# EAGLE board Replicape (EAGLE 5.12), part 1 of 2
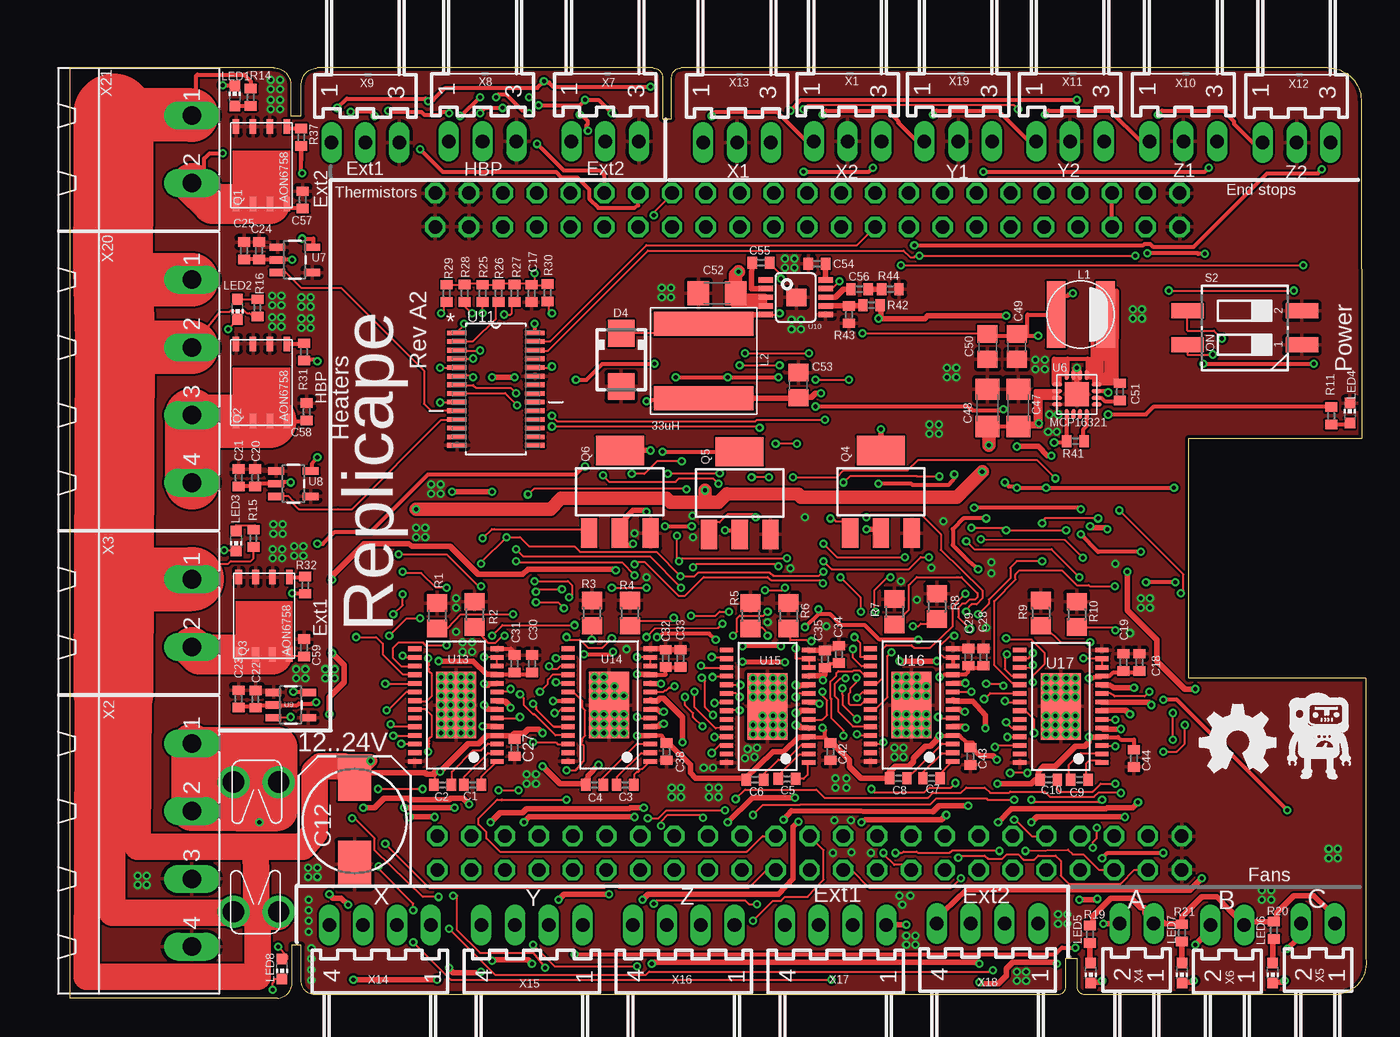
[diagram p3: board, top side]
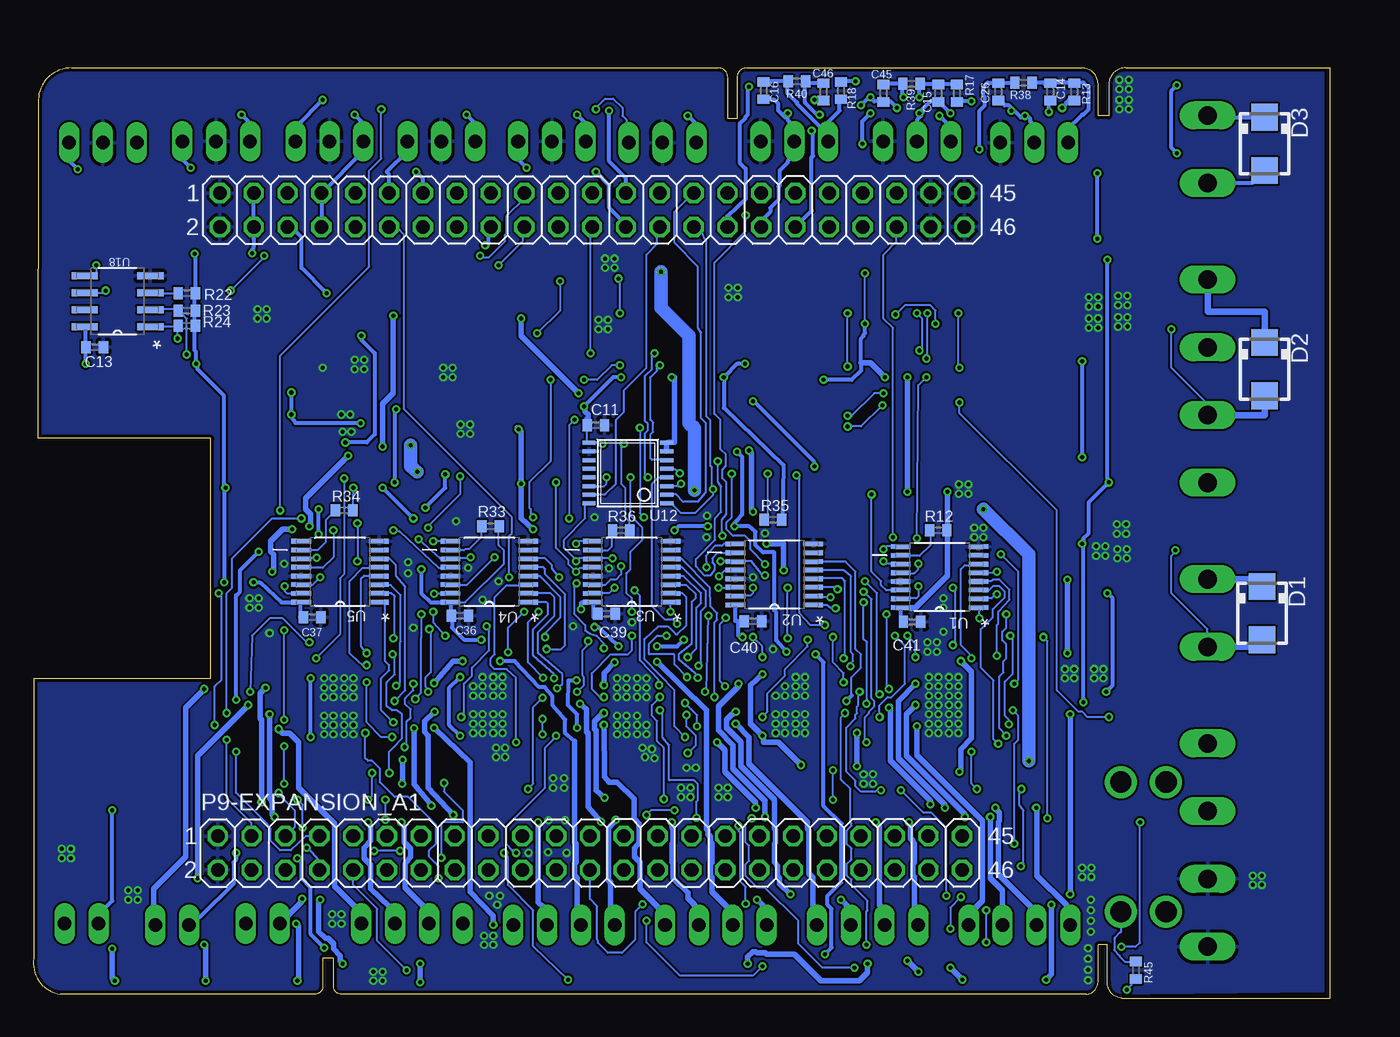
[diagram p4: board, bottom side, seen from below]

Size 97.32 x 69.8 mm. Coordinates in mm from the lower left corner, seen from the top.
Outline: 16.7,4 17.4,4 17.4,1.3 arc90 18.3,0.3 74.2,0.3 arc90 74.8,0.9 74.8,3 75.6,3 75.6,0.9 arc90 76.2,0.3 95.3,0.3 arc90 97.3,3 97.3,24 84,24 84,42 97,42 96.95,67.4 arc90 94.45,69.8 45.9,69.8 arc90 45.2,69.1 45.2,66 44.5,66 44.5,69.1 arc90 43.8,69.8 18.6,69.8 arc90 17.4,68.6 17.4,66.2 16.6,66.2 16.6,68.6 arc90 15.3,69.8 0,69.8 0,0 15.6,0 arc90 16.7,1.2 16.7,4
Copper layers (1*16): Top 0.035mm / dielectric 1.5mm / Bottom 0.035mm
Design rules "Fusion_eagle_rule_v1.1": minimum track width 6mil, minimum drill 12mil, track to track 6mil, track to pad 6mil, pad to pad 6mil, via to via 6mil, smd to smd 0mil, copper to edge 10mil, drill to drill 10mil, minimum pad ring 10mil, minimum via ring 6mil, stop-mask expansion 2mil, vias tented up to drill 100mil, thermal gap 10mil
Net classes: 1 power: width 1.27 mm

## Footprints (pad centres in the part's own frame; a part is rotated, then mirrored left to right if it is on the bottom)
C0402 = smd 0.7 x 0.9: 1 -0.65,0; 2 0.65,0
140CLH-0810 = smd 3.5 x 2.5: + 3.25,0; - -3.25,0
C1206 = smd 1.6 x 1.8: 1 -1.4,0; 2 1.4,0
C0805 = smd 1.3 x 1.5: 1 -0.95,0; 2 0.95,0
SMA = smd 2 x 2: A 2,0; C -2,0
3557 = drill 1.6 round: 1 -4.865,1.7; 2 -4.865,-1.7; 3 4.865,-1.7; 4 4.865,1.7
VLC5020 = smd 5 x 1.4: 1 0,1.85; 2 0,-1.85
NR8040T330 = smd 1.8 x 7.5: P$1 2.8,0; P$2 -2.8,0
CHIP-LED0603 = smd 0.8 x 0.8: A 0,-0.75; C 0,0.75
2X23 = drill 1.016 octagon: 1 -30.48,1.27; 2 -30.48,-1.27; 3 -27.94,1.27; 4 -27.94,-1.27; 5 -25.4,1.27; 6 -25.4,-1.27; 7 -22.86,1.27; 8 -22.86,-1.27; 9 -20.32,1.27; 10 -20.32,-1.27; 11 -17.78,1.27; 12 -17.78,-1.27; 13 -15.24,1.27; 14 -15.24,-1.27; 15 -12.7,1.27; 16 -12.7,-1.27; 17 -10.16,1.27; 18 -10.16,-1.27; 19 -7.62,1.27; 20 -7.62,-1.27; 21 -5.08,1.27; 22 -5.08,-1.27; 23 -2.54,1.27; 24 -2.54,-1.27; 25 0,1.27; 26 0,-1.27; 27 2.54,1.27; 28 2.54,-1.27; 29 5.08,1.27; 30 5.08,-1.27; 31 7.62,1.27; 32 7.62,-1.27; 33 10.16,1.27; 34 10.16,-1.27; 35 12.7,1.27; 36 12.7,-1.27; 37 15.24,1.27; 38 15.24,-1.27; 39 17.78,1.27; 40 17.78,-1.27; 41 20.32,1.27; 42 20.32,-1.27; 43 22.86,1.27; 44 22.86,-1.27; 45 25.4,1.27; 46 25.4,-1.27
8-DFN-EP-(5X6) = smd 0.5 x 1.1: 1 -1.905,2.9; 2 -0.635,2.9; 3 0.635,2.9; 4 1.905,2.9; 5 1.905,-2.9; 6 0.635,-2.9; 7 -0.635,-2.9; 8 -1.905,-2.9
SOT223 = smd 1.219 x 2.235: 1 -2.311,-3.099; 2 0,-3.099; 3 2.311,-3.099 | smd 3.6 x 2.2: 4 0,3.099
R0805 = smd 1.3 x 1.5: 1 -0.95,0; 2 0.95,0
R0402 = smd 0.7 x 0.9: 1 -0.65,0; 2 0.65,0
CTS-219-02 = smd 1.13 x 2.44: 1 -1.27,-4.3; 2 1.27,-4.3; 3 1.27,4.3; 4 -1.27,4.3
SOP65P640X120-16N = smd 1.473 x 0.356: 1 -2.921,2.286; 2 -2.921,1.626; 3 -2.921,0.965; 4 -2.921,0.33; 5 -2.921,-0.33; 6 -2.921,-0.965; 7 -2.921,-1.626; 8 -2.921,-2.286; 9 2.921,-2.286; 10 2.921,-1.626; 11 2.921,-0.965; 12 2.921,-0.33; 13 2.921,0.33; 14 2.921,0.965; 15 2.921,1.626; 16 2.921,2.286
QFN-16 = smd 0.75 x 0.3: 1 -1.475,0.75; 2 -1.475,0.25; 3 -1.475,-0.25; 4 -1.475,-0.75; 9 1.475,-0.75; 10 1.475,-0.25; 11 1.475,0.25; 12 1.475,0.75 | smd 0.3 x 0.75: 5 -0.75,-1.475; 6 -0.25,-1.475; 7 0.25,-1.475; 8 0.75,-1.475; 13 0.75,1.475; 14 0.25,1.475; 15 -0.25,1.475; 16 -0.75,1.475 | smd 1.8 x 1.8: P$17 0,0
SOT23-5 = smd 0.55 x 1.2: 1 -0.95,-1.3; 2 0,-1.3; 3 0.95,-1.3; 4 0.95,1.3; 5 -0.95,1.3
MSOP10 = smd 0.4 x 1.1: 1 -1.295,-2.35; 2 -0.645,-2.35; 3 0.005,-2.35; 4 0.655,-2.35; 5 1.305,-2.35; 6 1.305,2.15; 7 0.655,2.15; 8 0.005,2.15; 9 -0.645,2.15; 10 -1.295,2.15 | smd 1.3 x 1.5: EP 0.02,-0.04
SOP65P640X110-28N = smd 1.473 x 0.356: 1 -2.921,4.216; 2 -2.921,3.581; 3 -2.921,2.921; 4 -2.921,2.286; 5 -2.921,1.626; 6 -2.921,0.965; 7 -2.921,0.33; 8 -2.921,-0.33; 9 -2.921,-0.965; 10 -2.921,-1.626; 11 -2.921,-2.286; 12 -2.921,-2.921; 13 -2.921,-3.581; 14 -2.921,-4.216; 15 2.921,-4.216; 16 2.921,-3.581; 17 2.921,-2.921; 18 2.921,-2.286; 19 2.921,-1.626; 20 2.921,-0.965; 21 2.921,-0.33; 22 2.921,0.33; 23 2.921,0.965; 24 2.921,1.626; 25 2.921,2.286; 26 2.921,2.921; 27 2.921,3.581; 28 2.921,4.216
TSSOP-16 = smd 0.305 x 0.991: 1 -2.275,-2.918; 2 -1.625,-2.918; 3 -0.975,-2.918; 4 -0.325,-2.918; 5 0.325,-2.918; 6 0.975,-2.918; 7 1.625,-2.918; 8 2.275,-2.918; 9 2.275,2.918; 10 1.625,2.918; 11 0.975,2.918; 12 0.325,2.918; 13 -0.325,2.918; 14 -0.975,2.918; 15 -1.625,2.918; 16 -2.275,2.918
TSSOP-28 = smd 0.35 x 1: 1 -4.225,-3.087; 2 -3.575,-3.087; 3 -2.925,-3.087; 4 -2.275,-3.087; 5 -1.625,-3.087; 6 -0.975,-3.087; 7 -0.325,-3.087; 8 0.325,-3.087; 9 0.975,-3.087; 10 1.625,-3.087; 11 2.275,-3.087; 12 2.925,-3.087; 13 3.575,-3.087; 14 4.225,-3.087; 15 4.225,3.087; 16 3.575,3.087; 17 2.925,3.087; 18 2.275,3.087; 19 1.625,3.087; 20 0.975,3.087; 21 0.325,3.087; 22 -0.325,3.087; 23 -0.975,3.087; 24 -1.625,3.087; 25 -2.275,3.087; 26 -2.925,3.087; 27 -3.575,3.087; 28 -4.225,3.087 | smd 5 x 3: EXP 0,0
SOIC127P600X175-8N = smd 1.981 x 0.533: 1 -2.464,1.905; 2 -2.464,0.635; 3 -2.464,-0.635; 4 -2.464,-1.905; 5 2.464,-1.905; 6 2.464,-0.635; 7 2.464,0.635; 8 2.464,1.905
7395-03 = drill 1.016 long: 1 2.54,0; 2 0,0; 3 -2.54,0
MSTBA4 = drill 1.397 long: 1 -7.62,5.08; 2 -2.54,5.08; 3 2.54,5.08; 4 7.62,5.08
MSTBA2 = drill 1.397 long: 1 -2.54,5.08; 2 2.54,5.08
7395-02 = drill 1.016 long: 1 1.27,0; 2 -1.27,0
7395-04 = drill 1.016 long: 1 3.81,0; 2 1.27,0; 3 -1.27,0; 4 -3.81,0

## Placement (x,y rotation side)
C1  10nF  [C0402]  30.25,16 0 top
C2  0.1uF  [C0402]  28,16 0 top
C3  10nF  [C0402]  41.7,16 0 top
C4  0.1uF  [C0402]  39.4,16 0 top
C5  10nF  [C0402]  53.85,16.45 0 top
C6  0.1uF  [C0402]  51.45,16.4 0 top
C7  10nF  [C0402]  64.7,16.5 0 top
C8  0.1uF  [C0402]  62.2,16.5 0 top
C9  10nF  [C0402]  75.8,16.4 0 top
C10  0.1uF  [C0402]  73.5,16.4 0 top
C11  0.1uF  [C0402]  55.1,43 0 bottom
C12  100uF  [140CLH-0810]  21.4,13.3 90 top
C13  0.1uF  [C0402]  92.71,48.85 0 bottom
C14  0.47uF  [C0402]  21,68 270 bottom
C15  0.47uF  [C0402]  29.4,67.9 270 bottom
C16  0.47uF  [C0402]  42.5,68.1 270 bottom
C17  0.1uF  [C0402]  34.68,52.88 270 top
C18  4.7uF  [C0402]  80.3,25.2 90 top
C19  0.1uF  [C0402]  79.1,25.2 90 top
C20  0.1uF  [C0402]  13.93,39.05 90 top
C21  4.7uF  [C0402]  12.7,39.05 90 top
C22  0.1uF  [C0402]  13.95,22.45 90 top
C23  4.7uF  [C0402]  12.69,22.46 90 top
C24  0.1uF  [C0402]  14.22,56.09 90 top
C25  4.7uF  [C0402]  13.1,56.09 90 top
C26  0.47uF  [C0402]  24.9,68 270 bottom
C27  0.1uF  [C0402]  33.4,18.8 270 top
C28  4.7uF  [C0402]  68.6,25.6 90 top
C29  0.1uF  [C0402]  67.45,25.6 90 top
C30  4.7uF  [C0402]  34.7,25.1 90 top
C31  0.1uF  [C0402]  33.4,25.1 90 top
C32  4.7uF  [C0402]  44.75,25.5 90 top
C33  0.1uF  [C0402]  45.85,25.5 90 top
C34  4.7uF  [C0402]  57.75,25.8 90 top
C35  0.1uF  [C0402]  56.7,25.45 90 top
C36  0.1uF  [C0402]  65.3,28.7 0 bottom
C37  0.1uF  [C0402]  76.4,28.6 0 bottom
C38  0.1uF  [C0402]  44.8,18.5 270 top
C39  0.1uF  [C0402]  54.3,28.85 0 bottom
C40  0.1uF  [C0402]  43.3,28.3 0 bottom
C41  0.1uF  [C0402]  31.36,28.23 0 bottom
C42  0.1uF  [C0402]  57.1,18.5 270 top
C43  0.1uF  [C0402]  67.6,18.15 270 top
C44  0.1uF  [C0402]  79.9,18 270 top
C45  0.47uF  [C0402]  33.5,67.9 270 bottom
C46  0.47uF  [C0402]  38,68 270 bottom
C47  10uF  [C1206]  71.2,44.3 90 top
C48  10uF  [C1206]  68.9,44.3 90 top
C49  22uF  [C0805]  71.1,48.9 270 top
C50  22uF  [C0805]  68.9,48.9 270 top
C51  22nF  [C0402]  78.85,45.5 90 top
C52  10uF  [C1206]  48.6,52.9 180 top
C53  22uF  [C0805]  54.7,46 90 top
C54  10nF  [C0402]  56.1,55.1 180 top
C55  10nF  [C0402]  51.9,55.2 0 top
C56  1nF  [C0402]  59.3,53.2 0 top
C57  4.7nF  [C0402]  17.5,59.9 90 top
C58  4.7nF  [C0402]  17.8,44 90 top
C59  4.7nF  [C0402]  17.6,26.3 90 top
D1  MBRA340T3  [SMA]  5.1,28.9 270 bottom
D2  MBRA340T3  [SMA]  4.9,47.2 270 bottom
D3  MBRA340T3  [SMA]  4.9,64.1 270 bottom
D4  MBRA340T3  [SMA]  41.4,47.9 270 top
F1  3557  [3557]  14,11.35 270 top
L1  4.7uH  [VLC5020]  75.9,51.3 270 top
L2  33uH  [NR8040T330]  47.6,47.8 270 top
LED1  blue  [CHIP-LED0603]  12.4,67.7 0 top
LED2  blue  [CHIP-LED0603]  12.6,51.7 180 top
LED3  blue  [CHIP-LED0603]  12.5,34.3 180 top
LED4  blue  [CHIP-LED0603]  96.1,43.9 0 top
LED5  blue  [CHIP-LED0603]  76.65,1.9 180 top
LED6  blue  [CHIP-LED0603]  90.3,1.9 180 top
LED7  blue  [CHIP-LED0603]  83.5,1.9 180 top
LED8  red  [CHIP-LED0603]  15.95,2.2 180 top
LOGO1  OSHW_LOGO_FILLX0200-NT  [OSHW_FILLX200_NOTEXT]  84.85,16.95 0 top
P9-EXPANSION_A  BEAGLE_EXT9  [2X23]  52.84,59.14 0 bottom
P9-EXPANSION_A1  BEAGLE_EXT9  [2X23]  53,10.9 0 bottom
Q1  AON6758  [8-DFN-EP-(5X6)]  14.4,62.5 0 top
Q2  AON6758  [8-DFN-EP-(5X6)]  14.4,46.2 0 top
Q3  AON6758  [8-DFN-EP-(5X6)]  14.6,28.7 0 top
Q4  NIF5002  [SOT223]  60.9,38 0 top
Q5  NIF5002  [SOT223]  50.3,37.9 0 top
Q6  NIF5002  [SOT223]  41.3,38 0 top
R1  0.1R  [R0805]  27.6,28.7 270 top
R2  0.1R  [R0805]  30.4,28.8 270 top
R3  0.1R  [R0805]  42.05,28.9 270 top
R4  0.1R  [R0805]  39.2,28.9 270 top
R5  0.1R  [R0805]  51.1,28.7 270 top
R6  0.1R  [R0805]  53.95,28.7 270 top
R7  0.1R  [R0805]  61.9,29 270 top
R8  0.1R  [R0805]  65.1,29.4 270 top
R9  0.1R  [R0805]  72.9,28.9 270 top
R10  0.1R  [R0805]  75.6,28.8 270 top
R11  4.7K  [R0402]  94.7,43.7 90 top
R12  1K  [R0402]  29.4,35.1 0 bottom
R13  4K7, 1%  [R0402]  19.2,68 270 bottom
R14  4.7K  [R0402]  13.6,67.6 90 top
R15  4.7K  [R0402]  13.8,34.5 270 top
R16  4.7K  [R0402]  14.1,51.8 270 top
R17  4K7, 1%  [R0402]  28,67.9 270 bottom
R18  4K7, 1%  [R0402]  36.7,68.1 90 bottom
R19  4.7K  [R0402]  76.6,4.8 90 top
R20  4.7K  [R0402]  90.4,5.1 90 top
R21  4.7K  [R0402]  83.5,4.9 90 top
R22  4.7K  [R0402]  85.8,52.9 0 bottom
R23  4.7K  [R0402]  85.8,51.6 0 bottom
R24  4.7K  [R0402]  85.8,50.45 0 bottom
R25  1K  [R0402]  31.01,52.89 90 top
R26  1K  [R0402]  32.2,52.9 90 top
R27  1K  [R0402]  33.4,52.9 90 top
R28  1K  [R0402]  29.66,52.9 90 top
R29  1K  [R0402]  28.31,52.89 90 top
R30  1K  [R0402]  35.89,52.93 90 top
R31  100R  [R0402]  17.6,48.5 270 top
R32  100R  [R0402]  17.7,31 270 top
R33  1K  [R0402]  63,35.4 0 bottom
R34  1K  [R0402]  74,36.6 0 bottom
R35  1K  [R0402]  41.8,35.9 0 bottom
R36  1K  [R0402]  53.2,35.1 0 bottom
R37  100R  [R0402]  17.4,64.6 270 top
R38  6.8K  [R0402]  23,68.7 180 bottom
R39  6.8K  [R0402]  31.4,68.6 180 bottom
R40  6.8K  [R0402]  40,68.8 0 bottom
R41  10K  [R0402]  75.5,41.8 180 top
R42  120K  [R0402]  60.2,52 180 top
R43  10K  [R0402]  58.5,51.3 270 top
R44  40K  [R0402]  61.6,53.2 0 top
R45  4.7K  [R0402]  14.55,2.1 270 bottom
S2  219-02  [CTS-219-02]  88.2,50.3 90 top
U1  SN74AHC595PW  [SOP65P640X120-16N]  29.3,31.6 180 bottom
U2  SN74AHC595PW  [SOP65P640X120-16N]  41.7,31.8 180 bottom
U3  SN74AHC595PW  [SOP65P640X120-16N]  52.4,32 180 bottom
U4  SN74AHC595PW  [SOP65P640X120-16N]  63.1,32 180 bottom
U5  SN74AHC595PW  [SOP65P640X120-16N]  74.3,32 180 bottom
U6  MCP16321  [QFN-16]  75.6,45.3 0 top
U7  MCP1402  [SOT23-5]  16.9,55.4 270 top
U8  MCP1402  [SOT23-5]  16.8,38.6 270 top
U9  MCP1402  [SOT23-5]  16.6,22 270 top
U10  RT8268  [MSOP10]  54.6,52.6 270 top
U11  PCA9685PW  [SOP65P640X110-28N]  32,45.7 0 top
U12  DAC088S085  [TSSOP-16]  52.7,39.4 90 bottom
U13  DRV8825PWP  [TSSOP-28]  29,22 90 top
U14  DRV8825PWP  [TSSOP-28]  40.5,22 90 top
U15  DRV8825PWP  [TSSOP-28]  52.4,21.9 90 top
U16  DRV8825PWP  [TSSOP-28]  63.2,22 90 top
U17  DRV8825PWP  [TSSOP-28]  74.4,21.9 90 top
U18  CAT24C256  [SOIC127P600X175-8N]  91,52.3 180 bottom
U$1  [LOGO_BIG]  93.35,19.75 0 top
X1  22-05-7038-03  [7395-03]  58.4,64.3 180 top
X2  MSTBA4  [MSTBA4]  4.1,11.5 270 top
X3  MSTBA2  [MSTBA2]  4.1,28.9 270 top
X4  22-05-7028-02  [7395-02]  80.1,5.6 0 top
X5  22-05-7028-02  [7395-02]  93.7,5.6 0 top
X6  22-05-7028-02  [7395-02]  86.9,5.5 0 top
X7  22-05-7038-03  [7395-03]  40.2,64.3 180 top
X8  22-05-7038-03  [7395-03]  31,64.3 180 top
X9  22-05-7038-03  [7395-03]  22.2,64.2 180 top
X10  22-05-7038-03  [7395-03]  83.6,64.3 180 top
X11  22-05-7038-03  [7395-03]  75.1,64.3 180 top
X12  22-05-7038-03  [7395-03]  92.1,64.2 180 top
X13  22-05-7038-03  [7395-03]  50.1,64.2 180 top
X14  22-05-7048-04  [7395-04]  23.3,5.5 0 top
X15  22-05-7048-04  [7395-04]  34.7,5.5 0 top
X16  22-05-7048-04  [7395-04]  46.1,5.5 0 top
X17  22-05-7048-04  [7395-04]  57.5,5.5 0 top
X18  22-05-7048-04  [7395-04]  68.9,5.6 0 top
X19  22-05-7038-03  [7395-03]  66.7,64.3 180 top
X20  MSTBA4  [MSTBA4]  4.1,46.3 270 top
X21  MSTBA2  [MSTBA2]  4.1,63.7 270 top

## Tracks (layer width: path | path; a pad name or v marks a point on that pad's centre or on a via)
+3V3  (via drill 0.3)
  Top 0.152: v34.9,54.4 34.9,53.7 34.8,53.7 34.7,53.6 C17.1 | 34.9,50 U11.28 | C17.1 34.7,53.5 35.5,53.5 35.6,53.6 35.8,53.6 R30.2 | 33.4,53.6 34.3,53.6 34.4,53.5 34.6,53.5 C17.1 | 33.4,53.6 32.2,53.6 | 33.4,53.6 R27.2 | 32.2,53.6 32,53.6 31.9,53.5 31.1,53.5 R25.2 31,53.5 30.8,53.5 30.7,53.6 29.7,53.6 R28.2 29.6,53.6 29.4,53.6 29.3,53.5 28.4,53.5 R29.2 | 32.2,53.6 R26.2 | v54.6,41.6 v53,41.6
  Top 0.3: v85.1,47.6 v93.4,47.6 | v83,31.2 v80.8,31.2 | v68.2,32.2 67.5,32.8 66.3,34 66.3,35.2 67.1,36 v68.8,36 | v82.9,38.3 v73.3,38.3 v71.1,38.3 71,38.4 70.5,38.4 v70.2,38.7 | v63.7,26.9 60.8,26.9 59.7,28 57.9,28 57.1,28.8 56.2,28.8 | 56.2,28.8 v56.2,29.2 | v44.1,27.1 44.55,27.35 48,27.35 v48.5,26.9 | v53.4,26.4 v50.5,26.4 | 56.2,28.8 v55.2,27.85 | v53.2,46.6 v49.4,46.6 v45.5,46.6 | v56,44.4 67.4,44.4 67.6,44.2 67.7,44.2 67.8,44.1 69.8,44.1 69.9,44.2 v70.1,44.2 | v38,46.4 38.8,46.4 40,47.6 v43.9,47.6 | v34.9,50.6 34.9,50 | v85.2,55.85 84.7,55.85 84.65,55.9 v80.9,55.9
  Top 0.4: v31.7,46.6 v33.4,46.6 | v28.7,38 v31.7,38
  Bottom 0.152: C41.1 32.2,28.3 | 32.2,29.3 U1.16 | U2.16 44.6,29.5 | v34.9,50.6 v34.9,54.4 | 55.8,43 55.8,41.7 55.7,41.6 U12.9 55.6,41.7 55,41.7 54.9,41.8 54.8,41.8 v54.6,41.6 | R33.2 62.4,35.4 62.4,34 62,33.6 62,32.6 64.9,29.7 66,29.7 66.1,29.8 U4.16 | 66,28.7 C36.1 | R34.2 73.35,37.65 v73.3,38.3 | v53,41.6 53.2,41.4 53.2,38.6 52.9,38.3 52.9,36.1 52.6,35.8 52.6,35.1 R36.2 | 93.4,50.3 93.4,50.33 U18.8
  Bottom 0.3: 32.2,28.3 32.2,29.3 | 93.4,50.3 93.4,48.9 C13.1 93.4,48.8 v93.4,47.6 | 83,38.3 v83,31.2 | 83,38.3 83,45.2 85,47.2 85,47.5 v85.1,47.6 85.1,48.5 85.2,48.6 85.2,50.4 R24.2 85.2,50.5 85.2,51.5 R23.2 85.2,51.6 85.2,52.8 R22.2 85.15,55.65 85.2,55.7 v85.2,55.85 | v80.8,31.2 80.3,31.2 78.7,29.7 77.3,29.7 U5.16 77.3,29.6 77.3,28.6 C37.1 | 66,29.7 66,28.7 | v71.1,38.3 v68.8,36 | v82.9,38.3 83,38.3 | 66,29.7 U4.16 | 66,29.7 67.5,29.7 68.2,30.4 v68.2,32.2 | v63.7,26.9 65,26.9 65.9,27.8 65.9,28.7 C36.1 | v56.2,29.2 56.2,29.7 55.4,29.7 U3.16 55.3,29.6 55.3,28.6 C39.1 | 44.4,28.3 44.4,27.2 v44.1,27.1 | v48.5,26.9 49,26.4 v50.5,26.4 | v55.2,27.85 54.9,27.85 v53.4,26.4 | 44.4,28.3 C40.1 | 44.4,28.3 44.62,28.3 U2.16 | v53.2,46.6 53.8,46.6 v56,44.4 | v70.1,44.2 70.2,44.1 v70.2,38.7 | R35.2 41.1,36 41,40 45.5,44.3 v45.5,46.6 44.5,47.6 v43.9,47.6 | v38,46.4 35.9,46.4 35.2,47.1 35.2,47.7 35.2,49.5 35,49.7 35,49.8 34.9,49.9 v34.9,50.6 | P9-EXPANSION_A.3 80.8,60.4 80.8,57.9 P9-EXPANSION_A.4 80.8,57.75 80.8,57 80.75,56.95 80.75,56.4 80.8,56.35 80.8,56.25 80.9,56.15 v80.9,55.9
  Bottom 0.4: 32.2,29.3 31.1,29.3 28.7,31.7 28.7,34.9 | U12.7 U12.8 49.6,41.7 49.2,41.7 49.2,46.6 v49.4,46.6 | v33.4,46.6 34.5,47.7 35.2,47.7 | v31.7,38 v31.7,46.6 | 28.7,34.9 v28.7,38 | 28.7,34.9 R12.2 | v56,44.4 55.9,44.3 55.9,44 55.7,43.8 55.7,43.5 55.8,43.4 55.8,43 C11.1
AGND  (via drill 0.3)
  Top 0.3: v22.9,66.2 22.6,66.5 v21.1,66.5 | v30.8,66.4 31.2,66.8 v32.5,66.8 | v23.9,66.6 24,66.5 26.4,66.5 26.6,66.3 27.8,66.3 28,66.5 28.4,66.5 v28.5,66.4 | v40.7,66.4 39.7,67.4 v38.7,67.4 38.7,67.3 38.6,67.3 38.3,67 v35.2,67
  Bottom 0.3: 23.8,66.7 23.2,66.1 23,66.1 v22.9,66.2 22.8,66.3 22.5,66 22.5,65.8 22.2,65.5 X9.2 | 23.8,66.7 24.1,67 24.4,67 24.8,67.4 24.9,67.4 C26.2 | v21.1,66.5 21.1,67.4 21,67.4 C14.2 | X8.2 31,65.9 30.7,66.2 30.7,66.3 | 30.7,66.3 30.6,66.4 30.6,66.7 30,67.3 29.4,67.3 C15.2 29.3,67.4 29.2,67.3 29.2,67.1 v28.5,66.4 | v32.5,66.8 33,67.3 33.5,67.3 C45.2 33.6,67.3 34.2,67.3 v34.5,67.6 34.6,67.5 34.7,67.5 v35.2,67 | 30.7,66.3 v30.8,66.4 | 23.8,66.7 v23.9,66.6 | v38.7,67.4 38,67.4 C46.2 | C16.2 42.5,67.5 42,67.5 41.9,67.4 41.7,67.4 41.4,67.1 41.4,66.6 40.9,66.1 40.8,66.1 v40.7,66.4 40.7,65.9 40.6,65.8 40.6,65.7 40.2,65.3 X7.2 40.2,63.3 40.7,62.8 40.7,62.7 41.3,62.1 41.3,61 41.4,60.9 41.4,59.9 42,59.3 42,59 42.68,58.32 P9-EXPANSION_A.34
DIR_EXT_1  (via drill 0.3)
  Top 0.152: U16.20 59.52,22.98 v59.1,22.55 | v60.2,15.7 60.4,15.45 64.15,15.45 64.55,15.8 66.15,15.8 v66.5,16.15 | v66.7,10.55 66.85,10.7 68.7,10.7 68.95,10.45 70,10.45 70.35,10.8 71.2,10.8 71.6,10.4 72.4,10.4 72.7,10.7 74,10.7 74.4,10.3 74.4,9.2 75,8.6 78.9,8.6 79.93,9.63 P9-EXPANSION_A1.4
  Bottom 0.152: v59.1,22.55 59.8,21.85 59.8,16.1 v60.2,15.7 | v66.5,16.15 66.5,15.5 65.1,14.1 65.1,13.2 66.6,13.2 66.7,13.1 v66.7,10.55
DIR_EXT_2  (via drill 0.3)
  Top 0.152: v82.8,19.4 v82.8,21.4 | v77.2,36 73.2,36 v73,35.65 | v73,32.8 71.1,32.8 70.6,32.3 70.6,31.5 69,29.9 69,29.6 v68.2,28.8 | v68.65,22.45 69.1,22.9 71.3,22.9 U17.20
  Bottom 0.152: v82.8,19.4 82.8,15 80.94,13.14 P9-EXPANSION_A1.3 | v82.8,21.4 82.8,30.4 82.4,30.8 82.4,33 79.4,36 v77.2,36 | v73,35.65 v73,32.8 | v68.2,28.8 68.2,27.05 68.25,27 68.25,22.9 v68.65,22.45
DIR_X  (via drill 0.3)
  Top 0.152: v23.7,11.6 27,8.3 40.2,8.3 40.3,8.4 41.1,8.4 41.2,8.3 51,8.3 52.33,9.63 P9-EXPANSION_A1.26 | v23.8,21.6 23.9,21.6 25.3,23 25.9,23 U13.20
  Bottom 0.152: v23.7,11.6 23.7,19.1 23.4,19.4 23.4,21.2 v23.8,21.6
DIR_Y  (via drill 0.3)
  Top 0.152: v37.3,14.9 32.5,14.9 32.45,14.85 32.4,14.9 32.1,14.9 30.7,13.5 30.7,13.05 31.3,12.45 31.3,12 32.3,11 50.84,11 52.01,12.17 P9-EXPANSION_A1.25 | v37.3,17.1 38,17.1 38.1,17.2 38.6,17.8 38.6,18.9 38.4,19.1 38.4,19.2 38.5,19.3 38.5,19.5 38.7,19.7 38.7,21.6 38.5,21.8 38.5,22.3 37.8,23 37.5,23 U14.20
  Bottom 0.152: v37.3,14.9 v37.3,17.1
DIR_Z  (via drill 0.3)
  Top 0.152: U15.20 49.4,22.9 50,22.9 v50.3,22.6 | v50,14.95 50.7,15.65 56.05,15.65 56.65,15.05 64.45,15.05 64.8,15.4 66.9,15.4 67.3,15.8 68.7,15.8 69.1,15.4 70.5,15.4 70.6,15.5 73.2,15.5 73.6,15.1 76.9,15.1 77.25,15.45 78.75,15.45 78.85,15.45 v78.9,15.4
  Bottom 0.152: v50.3,22.6 50.9,22 50.9,21.2 50.5,20.8 50.5,19.3 50,18.8 v50,14.95 | v78.9,15.4 78.9,15.3 77.7,14.1 77.7,12.83 78.36,12.17 P9-EXPANSION_A1.5
END_STOP_X_1  (via drill 0.3)
  Top 0.3: v55.1,62 60,62 v60.3,62.3
  Bottom 0.3: v55.1,62 54.1,61 54.1,59.3 52.84,58.04 P9-EXPANSION_A.26 | v60.3,62.3 60.9,62.9 60.9,64.3 X1.3
END_STOP_X_2  (via drill 0.3)
  Top 0.3: v68.6,62 85.2,62 v85.5,62.3
  Bottom 0.3: v85.5,62.3 86.1,62.9 86.1,64.3 X10.3 | v68.6,62 68.08,61.48 P9-EXPANSION_A.13
END_STOP_Y_1  (via drill 0.3)
  Top 0.152: v82.1,18.5 83.1,18.5 83.7,19.1 v83.7,20.5 | v83.4,30.4 83.6,30.6 83.6,31.8 v78.8,36.6 | v71.2,66.7 70.9,67 55.4,67 v55.1,66.7
  Bottom 0.152: v82.1,18.5 82.1,15.4 79.7,13 79.7,12.9 79.5,12.7 79.5,11.8 78.8,11.1 78,11.1 76.9,12.15 76.87,12.17 P9-EXPANSION_A1.7 | v83.7,20.5 83.7,23.4 83.2,23.9 83.2,30.2 v83.4,30.4 | v78.8,36.6 78.8,48.2 72.1,54.9 72.1,62.1 71.2,63 v71.2,66.7 | v55.1,66.7 55,66.8 55,66.9 54.4,67.5 53.8,67.5 53.1,66.8 53.1,66.2 52.8,65.9 52.8,65.7 52.6,65.5 52.6,64.2 X13.3
END_STOP_Y_2  (via drill 0.3)
  Top 0.3: v75.6,67.4 54.9,67.4 v54.1,66.6
  Bottom 0.3: v75.6,67.4 77.6,65.4 77.6,64.3 X11.3 | v54.1,66.6 54.1,62.8 52.84,61.54 P9-EXPANSION_A.25
END_STOP_Z_1
  Bottom 0.3: X19.3 69.2,64.3 69.2,63.6 70.8,62 70.62,61.82 P9-EXPANSION_A.11
END_STOP_Z_2  (via drill 0.3)
  Top 0.3: v63.4,56.5 80.6,56.5 80.7,56.6 81.1,56.6 81.3,56.4 84.4,56.4 89.9,61.9 93.7,61.9 v94,62.2
  Bottom 0.3: v63.4,56.5 63.2,56.7 63.2,57.67 P9-EXPANSION_A.18 | v94,62.2 94.6,62.8 94.6,64.2 X12.3
EXT1_DECAY  (via drill 0.3)
  Top 0.152: U16.19 60.62,23.62 61,24 61,26.2 61.3,26.5 63.2,26.5 63.4,26.3 64.6,26.3 66.3,27.9 66.3,29.4 v67.25,30.35
  Bottom 0.152: U4.15 66.87,30.37 v67.25,30.35
EXT1_MODE0  (via drill 0.3)
  Top 0.152: v58.25,24 57.85,24 57.45,23.6 57.45,22.65 57.7,22.4 57.7,21.5 58.8,20.4 60.1,20.4 U16.24
  Bottom 0.152: v58.25,24 58.25,24.3 59.8,25.7 59.8,27.7 58.7,28.8 58.7,29.6 58.8,29.7 60.1,29.7 U4.1
EXT1_NENABLE  (via drill 0.3)
  Top 0.152: v57.85,31.6 59.4,30.05 v59.4,29 | v59.05,24.05 59.05,23.7 58.6,23.25 58.6,22.95 58.5,22.85 58.5,22.1 58.6,22 59.35,22 59.65,22.3 U16.21
  Bottom 0.152: v59.05,24.05 60.2,25.2 60.2,28.2 v59.4,29 | v57.85,31.6 58.4,32.25 58.4,32.5 58.9,33 60.1,33 U4.6
EXT1_NRESET  (via drill 0.3)
  Top 0.152: v58.9,27.1 59.35,26.65 59.35,25.6 60.09,25.6 U16.16
  Bottom 0.152: U4.4 59.27,31.67 57.75,30.1 57.75,28.6 58.9,27.4 v58.9,27.1
EXT1_NSLEEP  (via drill 0.3)
  Top 0.152: v58.8,26.2 58.8,25.55 59.45,24.9 60.09,24.9 U16.17
  Bottom 0.152: U4.5 59.03,32.33 58.9,32.2 58.9,31.8 57.4,30.3 57.4,26.5 57.7,26.2 v58.8,26.2
FAN_1  (via drill 0.3)
  Top 0.152: v31,34.5 31.7,35.2 31.9,35.2 39,35.2 39,35 Q6.1 | v30.3,46.6 30.2,46.7 29.1,46.7 U11.6
  Bottom 0.152: v31,34.5 30.9,46 v30.3,46.6
FAN_2  (via drill 0.3)
  Top 0.152: v57.1,36 57.3,36 57.5,35.8 58.6,35.8 58.6,35 Q4.1 | v56.7,43.4 51.6,43.4 51.5,43.3 36.6,43.3 v36.2,43.7 | v33.5,45.4 33.1,45.8 30.5,45.8 30.3,46 29.1,46 U11.7
  Bottom 0.152: v57.1,36 57.1,43 v56.7,43.4 | v36.2,43.7 35.9,43.7 34.2,45.4 v33.5,45.4
FAN_3  (via drill 0.3)
  Top 0.152: v51.5,36.1 51.3,36.3 49.4,36.3 48.8,35.7 48,35.7 48,34.9 Q5.1 | v51.8,42.8 51.7,42.9 v36.2,42.9 | v33.6,44.5 32.7,45.4 29.1,45.4 U11.8
  Bottom 0.152: v51.5,36.1 51.8,36.4 v51.8,42.8 | v33.6,44.5 35.2,42.9 v36.2,42.9
FAULT_EXT_1  (via drill 0.3)
  Top 0.152: U16.18 59.62,24.27 59.3,24.6 58.85,24.6 58.8,24.55 57.7,24.55 57.55,24.4 57.55,24.2 57.1,23.75 57.1,22.55 57.2,22.45 57.2,21 58.1,20.1 v58.1,19.7 | v61.1,10.9 61.1,10.8 61.9,10 62.79,10 P9-EXPANSION_A1.18
  Bottom 0.152: v58.1,19.7 58.3,19.4 58.9,18.8 58.9,15.8 61.8,12.9 61.8,11.55 61.4,11.1 61.3,11.1 v61.1,10.9
FAULT_EXT_2  (via drill 0.3)
  Top 0.152: v70.35,25.8 70.2,25.65 70.2,25.55 70.2,24.7 70.7,24.2 71.3,24.2 U17.18 | v71.9,16.9 v70.6,16.9 | v77.5,14.9 77.3,14.7 72.4,14.7 v72.2,14.9 | v77.1,12.8 77.1,12 76.8,11.7 v76.8,11.3
  Bottom 0.152: v70.35,25.8 70.2,25.65 70.2,25.55 70.2,24.3 70.8,23.7 70.8,21.9 70.4,21.6 70.05,21.6 69.65,21.3 69.65,19.5 70.3,18.8 70.6,18.5 v70.6,16.9 | v72.2,14.9 71.9,15.2 v71.9,16.9 | v77.1,12.8 77.1,14.5 v77.5,14.9 | v76.8,11.3 76.7,11.3 75.86,10.34 P9-EXPANSION_A1.8
FAULT_X  (via drill 0.3)
  Top 0.152: v69.3,2.1 69.2,2 43.5,2 43.25,1.75 31.95,1.75 v28.5,5.2 | v27.7,7.6 26.5,7.6 22.9,11.1 22.9,12 21.4,13.5 v21.2,13.5 | v21.5,27.1 23,27.1 23.5,26.6 23.5,25.8 25,24.3 25.9,24.3 U13.18
  Bottom 0.152: v69.3,2.1 71.5,4.3 71.5,6.7 73.32,8.52 P9-EXPANSION_A1.10 | v28.5,5.2 28.5,6.8 v27.7,7.6 | v21.2,13.5 21.2,26.8 v21.5,27.1
FAULT_Y  (via drill 0.3)
  Top 0.152: v70.9,13.4 71,13.4 72.23,12.17 P9-EXPANSION_A1.9 | v70.9,14.9 68.9,14.9 68.8,15 65.05,15 64.6,14.55 54.85,14.55 54.8,14.5 52.05,14.5 v51.3,13.75 | v49.2,14.1 44.8,14.1 44.2,13.5 v43.4,13.5 | v35.7,2.3 34.8,3.4 30.8,3.4 29.1,5.1 29.1,7.7 v28.8,7.7 | v32.2,15.6 v33.7,15.6 | v35.3,23 35.9,23.6 35.9,23.9 36.3,24.3 37.4,24.3 U14.18
  Bottom 0.152: v70.9,14.9 v70.9,13.4 | v49.2,14.1 50.95,14.1 v51.3,13.75 | v43.4,13.5 43.85,13.05 43.85,11.7 43.6,11.45 43.6,10.3 43.85,10.05 43.85,9.2 42.95,8.3 42.4,8.3 39.9,5.8 39.9,4.1 38.1,2.3 v35.7,2.3 | v28.8,7.7 28.8,12.8 29.9,13.9 30.5,13.9 v32.2,15.6 | v33.7,15.6 34,15.6 34.1,15.5 35.2,15.5 35.6,15.9 35.6,16.3 36.3,17 36.3,20.3 35.6,21 35.6,21.3 35.5,21.4 35.5,21.9 35.4,22 35.4,22.9 v35.3,23
FAULT_Z  (via drill 0.3)
  Top 0.152: U15.18 48.33,24.18 v48.25,24.1 | v49.8,27.2 50.1,27.5 50.1,28.5 50.3,28.7 52.1,28.7 v52.4,29 | v52.5,39.1 v51.2,39.1 | v50.7,48.4 v55.5,48.4
  Bottom 0.152: v48.25,24.1 49.2,25.05 49.2,25.8 51.1,25.8 51.1,26.6 50.5,27.2 v49.8,27.2 | v52.4,29 52.4,30 52.8,30.4 52.8,31.9 52.5,32.2 52.5,33.5 51.6,34.4 51.6,35.3 52.5,36.2 v52.5,39.1 | v51.2,39.1 51.4,39.3 51.4,42.4 51.2,42.6 51.2,43.1 51.4,43.3 51.4,46.7 50.9,47.2 50.9,48.2 v50.7,48.4 | v55.5,48.4 55.5,57.8 55.43,57.87 P9-EXPANSION_A.24
GND  (via drill 0.3)
  Top 0.3: U6.15 75.4,46.77 75.4,47.3 v75.6,47.3 | v75.6,47.3 75.8,47.3 75.8,46.8 75.6,46.8 | 75.6,46.7 75.6,46.8 | 75.6,46.8 v75.6,47.3 | U13.14 33.12,26.23 C31.2
  Top 0.4: U15.14 55.5,26.1 C35.2 57.65,26.35 C34.2 | U16.14 67.17,26.23 C29.2 | C33.2 C32.2 44.98,26.23 U14.14 | U6.P$17 75.6,46.7
  other vias: 54.2,50.9 54.9,50.9 54.9,50.2 54.2,50.2 53.7,55.5 54.4,55.5 53.7,54.8 54.4,54.8 72.5,47.9 73.2,47.9 73.2,47.2 72.5,47.2 73.55,43.8 74.2,43.8 74.1,42.5 73.45,42.5 62.1,24.1 62.8,24.1 63.6,24.1 64.3,22.7 63.6,22.7 64.3,23.4 63.6,23.4 62.8,23.4 62.8,22.7 62.1,23.4 62.1,22.7 73.3,24 80.4,30 80.4,29.3 81.1,29.3 81.1,30 17.9,9.8 18.6,9.8 17.9,9.1 18.6,9.1 5.1,9.2 5.8,9.2 5.1,8.5 5.8,8.5 17,24.7 17.7,24.7 17,24 17.7,24 19.2,24.7 19.9,24.7 19.2,24 19.9,24 26,35.3 26.7,35.3 26,34.6 26.7,34.6 27.15,38.55 27.85,38.55 27.15,37.85 27.85,37.85 29.5,26.7 30.2,26.7 29.5,26 30.2,26 39.4,24.1 40.1,24.1 39.4,23.4 40.1,23.4 40.9,23.4 39.4,22.7 40.1,22.7 40.9,22.7 41.6,22.7 39.4,21.3 40.1,21.3 40.9,21.3 41.6,21.3 39.4,20.6 40.1,20.6 40.9,20.6 39.4,19.9 40.1,19.9 40.9,19.9 41.6,19.9 41.6,20.6 48,15.8 48.7,15.8 48,15.1 48.7,15.1 34.3,16.8 35,16.8 34.3,16.1 35,16.1 62.1,19.9 62.1,20.6 62.1,21.3 74,24 74.8,24 75.5,24 73.3,23.3 74,23.3 74.8,23.3 75.5,23.3 73.3,22.6 74,22.6 74.8,22.6 75.5,22.6 73.3,21.2 74,21.2 74.8,21.2 75.5,21.2 73.3,20.5 74,20.5 74.8,20.5 75.5,20.5 73.3,19.8 74,19.8 74.8,19.8 75.5,19.8 78.5,32.6 69.2,32.7 64.7,32.3 57.5,16.5 58.3,16.5 57.5,15.8 58.3,15.8 45.2,15.8 45.9,15.8 45.2,15.1 45.9,15.1 50.9,18.7 51.6,18.8 50.7,18 51.4,18.1 79.6,27.4 51.3,24 54.1,32.25 53.5,24 52.8,24 52,24 51.3,23.3 52,23.3 52.8,23.3 53.5,23.3 51.3,22.6 52,22.6 52.8,22.6 53.5,22.6 52,21.2 52.8,21.2 53.5,21.2 68.8,27.8 55.2,36.1 69.2,31.9 65.6,35.8 43.3,31.6 62.4,31.3 41.8,26.2 15.1,68.9 15.8,68.9 15.1,68.2 15.8,68.2 15.1,67.4 15.8,67.4 15.1,66.7 15.8,66.7 15.2,52.7 15.9,52.7 15.2,52 15.9,52 15.2,51.1 15.9,51.1 15.2,50.4 15.9,50.4 17.4,52.6 18.1,52.6 17.4,51.9 18.1,51.9 17.4,51 18.1,51 17.4,50.3 18.1,50.3 47.6,17.3 48.3,17.3 56.8,27.9 63.6,29.9 46.8,34.6 46.75,36.2 62.8,21.3 63.6,21.3 64.3,21.3 62.8,20.6 63.6,20.6 64.3,20.6 62.8,19.9 63.6,19.9 64.3,19.9 51.3,20.5 52,20.5 52.8,20.5 53.5,20.5 51.3,19.8 52,19.8 52.8,19.8 53.5,19.8 63.1,7.7 62.3,7.7 62.5,7 62.8,4.7 63.5,4.7 62.8,4 63.5,4 17.95,7.4 17.95,6.6 17.95,5.8 17.95,5 18.15,3.75 18.15,2.95 18.15,2.15 18.15,1.35 94.5,11.2 95.2,11.2 94.5,10.5 95.2,10.5 89.5,8.1 90.2,8.1 89.5,7.4 90.2,7.4 71.1,2 71.8,2 71.1,1.3 71.8,1.3 74.2,6.3 74.9,6.3 74.2,5.6 74.9,5.6 42.4,34.9 61.9,18.1 61.9,18.8 62.6,18.8 62.6,18.1 52.4,28.2 29,30 29,29.3 29,27.5 27.9,24.1 28.6,24.1 29.4,24.1 30.1,24.1 27.9,23.4 28.6,23.4 29.4,23.4 30.1,23.4 27.9,22.7 28.6,22.7 29.4,22.7 30.1,22.7 27.9,22 28.6,22 29.4,22 30.1,22 27.9,21.3 28.6,21.3 30.1,21.3 27.9,20.6 28.6,20.6 29.4,20.6 30.1,20.6 27.9,19.9 28.6,19.9 29.4,19.9 30.1,19.9 29.4,21.3 57.4,13.35 58.65,13.35 57.3,10.9 58.7,10.95 60.15,10.9 15.3,35.55 16,35.55 15.3,34.85 16,34.85 15.25,33.7 15.95,33.7 15.25,33 15.95,33 16.85,33.9 17.55,33.9 16.85,33.2 17.55,33.2 64.55,43.05 65.25,43.05 64.55,42.35 65.25,42.35 65.85,47.3 66.55,47.3 65.85,46.6 66.55,46.6 44.45,53.3 45.15,53.3 44.45,52.6 45.15,52.6 79.8,51.7 80.5,51.7 79.8,51 80.5,51
  pour Top: 0.5,69.7 95.7,69.9 arc-90 97.7,68 97.6,42 84,42 84,24 97.3,23.9 97.4,0.3 0.5,0.3
  pour Bottom: 95.5,69.8 0.5,69.8 0.5,0.5 16.8,0.3 97.4,0.3 97.3,23.9 84,24 84,42 97.6,42 97.6,67.6 arc90
HEATER_EXT_1  (via drill 0.3)
  Top 0.152: v27.8,44.7 29,44.7 U11.9 | v16.6,21.1 15.3,21.1 U9.3
  Bottom 0.152: v27.8,44.7 27.8,43.9 20.5,36.6 20.5,23.1 18.9,21.5 18.6,21.5 18.2,21.1 v16.6,21.1
HEATER_EXT_2
  Top 0.152: U11.10 29,44.1 27.1,44.1 26.6,44.6 26.6,47.1 20.4,53.3 17.4,53.3 16.2,54.5 15.6,54.5 U7.3
HEATER_HBP
  Top 0.152: U11.11 29,43.4 27.9,43.4 21.2,36.7 20.15,36.7 17.2,36.7 16.8,37.1 16.8,37.3 16.4,37.7 15.5,37.7 U8.3
I2C2_SCL  (via drill 0.3)
  Top 0.152: v80,55.7 v63.8,55.7 63.5,55.7 63.4,55.6 63.1,55.6 62.6,56.1 43.4,56.1 35.9,48.6 35,48.6 U11.26 | v82.5,53.1 v91.9,53.1
  Bottom 0.152: v63.8,55.7 63.7,55.6 63.1,55.6 61.9,56.8 61.9,57.3 61.8,57.4 61.8,58.7 60.46,60.04 P9-EXPANSION_A.19 | v80,55.7 80,55.6 v82.5,53.1 | v91.9,53.1 92.1,52.9 93.43,52.9 U18.6
I2C2_SDA  (via drill 0.3)
  Top 0.152: v62.4,55 v92.6,55 | U11.27 35,49.3 36.1,49.3 43.3,56.5 59.1,56.5 60,57.4 60,57.41 P9-EXPANSION_A.20
  Bottom 0.152: v62.4,55 60.6,56.8 60.6,57.73 P9-EXPANSION_A.20 | v92.6,55 92.6,54.2 93.3,54.2 93.31,54.2 U18.5
N$1  (via drill 0.3)
  Top 0.152: U13.19 25.9,23.6 v23.7,23.6 | v24.7,33.3 28.3,33.3 30.7,30.9 v30.9,30.9
  Bottom 0.152: v30.9,30.9 30.9,30.15 31.05,30 32.2,30 U1.15 | v24.7,33.3 23.4,32 23.4,23.9 v23.7,23.6
N$2  (via drill 0.3)
  Top 0.152: U13.24 25.9,20.4 24.2,20.4 v24.1,20.55 | v26.3,28.5 25.3,28.5 v24,27.2
  Bottom 0.152: v26.3,28.5 26.3,29.3 U1.1 | v24.1,20.55 24.1,20.9 24.4,21.2 24.4,23.75 23.8,24.35 23.8,26.95 v24,27.2
N$3  (via drill 0.3)
  Top 0.152: v24.3,28.8 25,29.5 v25,30.3 | v24.3,19.7 25.9,19.7 U13.25
  Bottom 0.152: v24.3,28.8 24.3,27.8 24.6,27.5 24.6,26.85 24.3,26.55 24.3,25.5 24.5,25.3 24.5,24.45 24.8,24.15 24.8,20.25 v24.3,19.7 | v25,30.3 25.1,30.3 25.4,30 26.35,30 U1.2
N$4  (via drill 0.3)
  Top 0.152: v24.9,19.1 25.9,19.1 U13.26
  Bottom 0.152: v24.9,19.1 25.25,19.45 25.25,23.85 26.2,24.8 26.2,27.7 25.3,28.6 25.3,29.2 24.4,30.1 24.4,30.5 24.8,30.9 25.3,30.9 25.6,30.6 26.34,30.6 U1.3
N$7  (via drill 0.3)
  Top 0.406: v31,20.4 32,20.4 U13.5
  Bottom 0.406: v31,20.4 31,18.25 26.1,13.3 26.1,7.3 27.1,6.3 X14.1
N$8  (via drill 0.3)
  Top 0.152: v15.25,0.65 15.25,1.15 15.35,1.25 15.35,1.45 LED8.C
  Bottom 0.152: R45.2 14.9,1.45 14.9,1 v15.25,0.65
N$9
  Top 0.406: R19.1 76.6,2.8 76.5,2.7 76.6,2.6 LED5.A
N$13  (via drill 0.3)
  Top 0.406: v31.1,22 31.4,21.7 32,21.7 U13.7 | v25.5,13.6 v27.4,13.6
  Bottom 0.406: v31.1,22 31.8,21.3 31.8,18.2 27.4,13.8 v27.4,13.6 | v25.5,13.6 25.5,9 24.6,8.1 24.6,5.5 X14.2
N$14  (via drill 0.3)
  Top 0.406: v31.1,23.6 31.2,23.5 31.4,23.5 31.5,23.6 32,23.6 U13.10 | v25.1,14.3 v28.9,14.3
  Bottom 0.406: v31.1,23.6 32.4,22.3 32.4,18 28.9,14.5 v28.9,14.3 | v25.1,14.3 25.1,14.2 24.8,13.9 24.8,13.3 24.9,13.2 24.9,9.3 22,6.4 22,5.5 X14.3
N$15  (via drill 0.3)
  Top 0.406: v33.1,21.8 33,22 32.7,22.3 32.1,22.3 U13.8 | v30,14.55 29.55,15 28.6,15 28.5,14.9 25.5,14.9 25.4,15 23.6,15 22.9,14.3 v22.05,14.3
  Bottom 0.406: v33.1,21.8 33,21.9 33,17.8 30,14.8 v30,14.55 | v22.05,14.3 22,14.4 22,9.2 19.8,7 19.8,6.9 19.5,6.6 X14.4
N$16
  Top 0.152: C1.1 29.6,16.6 31.4,18.4 32,18.4 U13.2
N$17
  Top 0.152: C1.2 30.9,16.6 32,17.7 U13.1
N$18  (via drill 0.3)
  Top 0.152: v33.1,23.2 32.9,23 32.1,23 U13.9 | v33.3,28.8 29.35,28.8 28.4,27.8 27.6,27.8 R1.2
  Bottom 0.152: v33.1,23.2 33.3,23.4 v33.3,28.8
N$19  (via drill 0.3)
  Top 0.152: U13.6 33.73,21.02 v33.8,21.1 | v32.65,27.2 32.5,27.2 31.95,26.65 31.45,26.65 R2.2
  Bottom 0.152: v33.8,21.1 33.8,22 33.2,22.6 32.9,22.6 31.9,23.6 31.9,26.45 v32.65,27.2
N$21  (via drill 0.3)
  Top 0.3: v16.8,23 17.9,23 U9.5 | v16.7,30.4 17.7,30.4 R32.2
  Bottom 0.3: v16.8,23 16.3,23.5 16.3,30 v16.7,30.4
N$22
  Top 0.152: C2.2 28.7,16 28.7,17 30.3,18.6 30.9,18.6 31.4,19.1 32,19.1 U13.3
N$23
  Top 0.3: Q1.4 16.45,65.25 R37.1
N$24  (via drill 0.3)
  Top 0.152: U14.19 36.58,23.62 v36.5,23.7 | 37.3,27 37.5,26.9 38.3,26.9 38.9,26.3 40,26.3 v40.7,27 | v40.7,30.8 v43.3,30.8
  Top 0.3: v37.3,27.1 37.3,27
  Bottom 0.152: v36.5,23.7 36.5,24.4 37.3,25.2 v37.3,27.1 | v40.7,27 v40.7,30.8 | v43.3,30.8 43.3,30.4 43.5,30.2 44.59,30.2
  Bottom 0.3: 44.59,30.2 U2.15
N$25  (via drill 0.3)
  Top 0.152: 36.4,20.4 36.42,20.38 U14.24 36.33,20.38 35,21.7 35,21.9 v34.8,22.1 | v35,29.7 36.65,29.7 v37.1,29.25
  Bottom 0.152: v34.8,22.1 34.8,22.3 34.75,22.4 34.75,26.7 35,26.95 v35,29.7 | v37.1,29.25 37.45,29.25 37.75,29.5 38.77,29.5 U2.1
N$26  (via drill 0.3)
  Top 0.152: U14.25 36.48,19.73 34.9,21.3 34.8,21.3 34.1,22 34.1,22.5 v33.8,22.8 | v34.9,31.3 37.4,31.3 37.7,31 37.7,30.25 v37.5,30.1
  Bottom 0.152: v33.8,22.8 34,23 34,30.4 v34.9,31.3 | v37.5,30.1 38.7,30.1 U2.2
N$27  (via drill 0.3)
  Top 0.152: U14.26 36.62,19.07 36.5,19.2 v34.8,19.2 | v36.95,30.7 35.2,30.7 v35,30.5
  Bottom 0.152: U2.3 37.09,30.84 v36.95,30.7 | v35,30.5 34.4,29.95 34.4,22.5 34.2,22.3 34.2,21.9 34.6,21.5 34.6,21.4 34.9,21.1 34.9,19.3 v34.8,19.2
N$28  (via drill 0.3)
  Top 0.152: U14.16 36.5,25.57
  Top 0.3: 36.5,25.57 v36.5,25.5
  Bottom 0.152: v36.5,25.5 36.4,25.75 36.4,31.3 36.6,31.5 38.78,31.5
  Bottom 0.3: 38.78,31.5 U2.4
N$29  (via drill 0.3)
  Top 0.152: U14.17 36.83,24.93 36.6,24.7 36.2,24.7 v36,24.9
  Bottom 0.152: v36,24.9 36,25.1 35.8,25.3 35.8,25.8 35.95,25.95 35.95,31.65 36,31.7 36.5,32.1 38.75,32.1
  Bottom 0.3: 38.75,32.1 U2.5
N$30  (via drill 0.3)
  Top 0.3: U14.5 43.6,20.4
  Top 0.406: v44.6,20.6 44.4,20.6 44.2,20.4 43.7,20.4 U14.5
  Bottom 0.406: v44.6,20.6 43.6,19.6 43.6,17.6 39.2,13.2 39.2,12.7 39.1,12.6 39.1,9.35 38.8,9.05 38.8,6.9 38.5,6.6 X15.1
N$31  (via drill 0.3)
  Top 0.406: v44.6,21.5 44.3,21.5 44.1,21.7 43.6,21.7 U14.7 | v40.5,7.8 37.1,7.8 v36.7,7.4
  Bottom 0.406: v44.6,21.5 44.8,21.3 44.9,21.3 45.3,20.9 45.3,20.3 44.2,19.2 44.2,17.4 41.7,14.9 41.7,12.7 41.6,12.6 41.6,11.7 41.7,11.6 41.7,10.2 41.45,9.95 41.45,9.15 41.3,9 41.3,8.6 v40.5,7.8 | v36.7,7.4 36.3,7 36.3,6.9 36,6.6 36,5.5 X15.2
N$32  (via drill 0.3)
  Top 0.406: v44.4,23.6 43.6,23.6 U14.10 | v42.4,13.6 34.5,13.6 v34.1,13.2
  Bottom 0.406: v44.4,23.6 44.4,23.4 45.9,21.9 45.9,20.1 44.8,19 44.8,17.2 42.4,14.8 v42.4,13.6 | v34.1,13.2 33.8,12.9 33.8,7 33.4,6.6 33.4,5.5 X15.3
N$33  (via drill 0.3)
  Top 0.406: v46,19.2 46,21.1 44.6,22.5 44.3,22.5 44.1,22.3 43.7,22.3 43.6,22.4 U14.8 | v43.1,14.3 42.1,14.3 42,14.2 34.3,14.2 34,13.9 32.3,13.9 v31.6,13.2
  Bottom 0.406: v46,19.2 45.4,18.6 45.4,17 43.1,14.7 v43.1,14.3 | v31.6,13.2 31.5,13.1 31.5,12 31.3,11.8 31.3,11.7 31.2,11.6 31.2,10.2 31.3,10.1 31.3,9.2 31.2,9.1 31.2,6.9 30.9,6.6 X15.4
N$34
  Top 0.152: U14.2 43.5,18.4 42.9,18.4 41.1,16.6 41.1,16 C3.1
N$35
  Top 0.152: U14.1 43.5,17.7 43,17.2 42.9,17.2 42.7,17 42.6,17 42.4,16.8 42.4,16 C3.2
N$36  (via drill 0.3)
  Top 0.152: v45.4,23.4 45.3,23.3 45,23.3 44.8,23.1 44.7,23.1 44.6,23 43.6,23 U14.9 | v45.35,28.55 45.15,28.3 42.55,28.3 R3.2
  Bottom 0.152: v45.35,28.55 45.8,28.05 45.8,23.8 v45.4,23.4
N$37  (via drill 0.3)
  Top 0.152: v42.6,21.1 42.7,21 43.5,21 U14.6 | v39.2,26.9 R4.2
  Bottom 0.152: v42.6,21.1 42.2,21.5 42.2,22.9 40.9,24.2 40.9,24.7 39.2,26.4 v39.2,26.9
N$38
  Top 0.152: U14.3 43.5,19.1 42.6,19.1 40,16.5 40,16 C4.2
N$39  (via drill 0.3)
  Top 0.152: U14.21 37.39,22.3
  Top 0.3: 37.39,22.3 v36.3,22.3
  Bottom 0.152: U2.6 36.37,32.77 35.6,32 35.6,26.2 35.2,25.8 35.2,24.8 35.9,24.1 35.9,22.7
  Bottom 0.3: v36.3,22.3 35.9,22.7
N$41  (via drill 0.3)
  Top 0.3: v17.45,57 18.3,57 18.3,56.4 U7.5 | v17.45,61.9 17.4,61.9 R37.2 17.4,62.9
  Bottom 0.3: v17.45,57 v17.45,61.9
N$42  (via drill 0.3)
  Top 0.152: U15.19 50.12,23.52 v50.35,23.5 | v52.2,30.6 53.5,30.6 v53.7,30.8
  Bottom 0.152: v50.35,23.5 50.4,23.9 51.8,25.35 51.8,30.2 v52.2,30.6 | v53.7,30.8 54.1,30.4 55.3,30.4 U3.15
N$43  (via drill 0.3)
  Top 0.152: v46.65,28.7 48.5,28.7 48.8,29 v49.5,29 | v46.9,23 46.9,21.85 48.5,20.25 49.3,20.3 U15.24
  Bottom 0.152: v49.5,29 49.5,29.7 U3.1 | v46.65,28.7 46.8,23.1 v46.9,23
N$44  (via drill 0.3)
  Top 0.152: v48.4,19.6 49.4,19.6 U15.25
  Bottom 0.152: v48.4,19.6 49.2,20.4 49.2,23.1 51.45,25.45 51.45,26.95 50.4,27.9 49.7,27.9 49.1,27.3 49,27.3 48.3,28 48.3,30.1 48.6,30.4 49.45,30.4 U3.2
N$45  (via drill 0.3)
  Top 0.152: v47.45,24.05 47.7,23.8 47.7,21.85 v48.3,21.25 | v48.2,18.4 48.8,19 49.3,19 U15.26
  Bottom 0.152: v47.45,24.05 47.45,24.2 48.85,25.4 48.85,25.85 47.9,26.65 47.9,29.75 47.6,30.05 47.6,30.3 48.3,31 49.4,31 U3.3 | v48.2,18.4 47.6,19 47.6,19.7 48.3,20.4 v48.3,21.25
N$46  (via drill 0.3)
  Top 0.152: v48.2,25.6 49.19,25.6 U15.16
  Bottom 0.152: U3.4 48.52,31.67 47.2,30.4 47.2,29.65 47.55,29.3 47.55,26.25 v48.2,25.6
N$47  (via drill 0.3)
  Top 0.152: v47.4,24.95 47.55,24.8 49.3,24.8 U15.17
  Bottom 0.152: U3.5 49.4,32.3 48.65,32.35 46.85,30.55 46.85,29.4 47.2,29.05 47.2,25.2 47.35,25 v47.4,24.95
N$48  (via drill 0.3)
  Top 0.406: v54.5,20.5 54.7,20.5 54.9,20.3 55.4,20.3 U15.5
  Bottom 0.406: v54.5,20.5 54.45,16.6 54.1,16.2 53.5,16.2 52.25,14.95 52.25,13.5 51.85,13.1 51.85,11.65 52.2,11.25 52.2,10.6 51.8,10.2 51.8,8.2 49.9,6.3 X16.1
N$49  (via drill 0.3)
  Top 0.406: v54.5,21.4 54.7,21.4 54.9,21.6 55.4,21.6 U15.7 | v54.45,15.05 51.25,15.05 v49.4,13.2
  Bottom 0.406: v54.5,21.4 54.7,21.2 54.8,21.2 55.2,20.8 55.2,20.2 55.1,20.1 55.1,15.6 v54.45,15.05 | v49.4,13.2 49.4,12.8 49.3,12.7 49.3,11.7 49.4,11.6 49.4,10.2 49.3,10.1 49.3,9 48.2,7.9 48.2,7.5 47.7,7 47.7,6.9 47.4,6.6 47.4,5.5 X16.2
N$50  (via drill 0.3)
  Top 0.406: v54.5,23.5 54.6,23.4 54.8,23.4 54.9,23.5 55.4,23.5 U15.10 | v50.5,25.25 v53.7,25.2
  Bottom 0.406: v54.5,23.5 54.5,24.4 v53.7,25.2 | v50.5,25.25 46.8,21.6 46.8,12.7 46.7,12.6 46.7,12.3 46.5,12.1 46.5,11.7 46.4,11.6 46.4,10.2 46.5,10.1 46.5,9.15 46.4,9.05 46.4,8 44.8,6.4 44.8,5.5 X16.3
N$51  (via drill 0.3)
  Top 0.3: 55.5,22.2 U15.8
  Top 0.4: v56.3,22.1 56.1,22.2 55.5,22.2
  Top 0.406: v54.7,13.25 54.3,12.85 54.3,8.95 53.2,7.8 43.4,7.8 v43,7.4
  Bottom 0.406: v56.3,22.1 55.8,21.7 55.8,20 55.7,19.9 55.7,14.35 v54.7,13.25 | v43,7.4 42.6,7 42.6,6.9 42.3,6.6 X16.4
N$52
  Top 0.152: C5.1 53.25,16.75 54.8,18.3 55.46,18.3 U15.2
N$53
  Top 0.152: C5.2 55.1,16.45 55.4,16.75 55.4,17.59 U15.1
N$54  (via drill 0.3)
  Top 0.152: v54.5,22.6 54.8,22.9 55.4,22.9 U15.9 | v52.4,27.2 52.4,27.4 52,27.8 51.1,27.8 R5.2
  Bottom 0.152: v54.5,22.6 54.8,22.6 55.4,23.2 55.4,24.4 54,25.8 52.7,25.8 52.4,26.1 v52.4,27.2
N$55  (via drill 0.3)
  Top 0.152: v56.5,23 56.5,22.7 56.85,22.35 56.85,21.25 56.5,20.9 55.5,20.9 U15.6 | v55.7,26.8 55.4,26.8 55.35,26.85 54.1,26.85 54.1,27.5 54.15,27.7 54.6,27.8 54,27.8 R6.2
  Bottom 0.152: 55.45,26.75 56.1,26.1 56.1,24.2 56,24.1 56,23.5 v56.5,23 | 55.45,26.75 55.4,26.8 | 55.45,26.75 v55.7,26.8
N$56
  Top 0.152: C6.2 51.9,16.2 | 51.9,16.2 51.85,16.15 | 51.9,16.2 51.9,16.6 53.2,17.9 53.8,17.9 54.9,19 55.46,19 U15.3
N$57  (via drill 0.3)
  Top 0.152: v46.2,22.6 46.2,22 46.8,21.4 46.8,21.1 v47.5,20.4 | v48.4,22.15 48.5,22.2 49.3,22.2 U15.21
  Bottom 0.152: v46.2,22.6 46.2,28.2 46,28.4 46,28.9 46.5,29.4 46.55,30.8 48.7,33 49.4,33 U3.6 | v47.5,20.4 47.5,21.25 v48.4,22.15
N$58  (via drill 0.3)
  Top 0.152: v29.6,50.6 29.6,50.5 29.1,50 U11.1 | v32.6,51.3 33.1,51.3 33.2,51.4 33.2,52.3 33.4,52.3 R27.1
  Bottom 0.152: v29.6,50.6 29.6,51.6 30,52 31.9,52 v32.6,51.3
N$59
  Top 0.152: U11.2 29.1,49.3 30.3,49.3 32,51 32,52.3 32.2,52.3 R26.1
N$60
  Top 0.3: Q2.4 17.6,49.1 R31.1
N$61  (via drill 0.3)
  Top 0.3: v18.6,40.6 18.2,40.1 18.2,39.6 U8.5 | v18.6,47.8 18.5,47.9 17.6,47.9 R31.2
  Bottom 0.3: v18.6,40.6 v18.6,47.8
N$62  (via drill 0.3)
  Top 0.152: v59.1,20.95 58.05,22 58.05,22.7 58,22.8 v58,23.25 | v59.1,19.8 59.2,19.7 60.1,19.7 U16.25
  Bottom 0.152: v58,23.25 57.6,23.6 57.6,24.3 57.65,24.35 59.45,25.9 59.45,27.45 58.2,28.7 58.2,30.1 58.5,30.4 60.1,30.4 U4.2 | v59.1,19.8 v59.1,20.95
N$63  (via drill 0.3)
  Top 0.152: v61.1,19.2 61,19.1 60.2,19.1 U16.26
  Bottom 0.152: v61.1,19.2 61.1,24.05 61.8,24.7 62.7,24.7 63,25 63,25.5 62.7,25.8 62.7,30.1 61.8,31 60.2,31 U4.3
N$64  (via drill 0.3)
  Top 0.3: v11.5,68.5 12.4,68.5 LED1.C | v11.5,63.4 10.5,63.4 10.1,63 10.1,61.16 X21.2 | C57.1 17.5,59.3 16.3,59.3 Q1.5 Q1.6
  Top 3: X21.2 10.74,59.6 Q1.8 Q1.7 Q1.6
  Bottom 0.3: X21.2 5.84,61.16 D3.A | v11.5,63.4 11.9,63.8 11.9,68.1 v11.5,68.5
N$66  (via drill 0.3)
  Top 0.406: v67.25,20.3 67.2,20.4 66.3,20.4 U16.5 | X17.1 v62.8,5.5
  Bottom 0.406: v67.25,20.3 64.55,17.7 64.55,8 62.8,6.2 v62.8,5.5
N$67  (via drill 0.3)
  Top 0.406: v67.2,21.5 67,21.5 66.8,21.7 66.3,21.7 U16.7 | v65.8,13.75 65.45,13.4 59.75,13.4 v59.45,13.2
  Bottom 0.406: v67.2,21.5 67.95,20.8 67.95,20 67.7,19.7 67.7,15.8 v65.8,13.75 | v59.45,13.2 59.45,7.2 59.05,6.85 | 59.05,6.85 58.8,6.6 58.8,5.5 X17.2 | 59.05,6.85 59.1,6.9
N$68  (via drill 0.3)
  Top 0.406: v67.25,23.65 66.35,23.65 U16.10 | v62.3,25.3 v65.1,25.3
  Bottom 0.3: 56.7,19.3 57.4,19.9 57.4,20.9 58.35,22 58.35,22.65 58.95,23.35 59.35,23.35 61.2,25.3 v62.3,25.3
  Bottom 0.406: v67.25,23.65 66.6,24.4 65.8,25.3 v65.1,25.3 | 56.7,19.3 56.7,11.7 56.6,11.6 56.6,10.2 56.7,10.1 56.7,9.2 56.5,9 56.5,6.9 56.2,6.6 56.2,5.5 X17.3
N$69  (via drill 0.3)
  Top 0.406: v68.75,20.25 68.75,21.25 67.8,22.3 66.4,22.3 66.3,22.4 U16.8 | v67.45,14.45 65.25,14.45 64.8,14 54.2,14.05 v53.6,13.4
  Bottom 0.406: v67.45,14.45 67.6,14.7 68.75,16.05 v68.75,20.25 | v53.6,13.4 54.15,12.75 54.15,8.85 54,8.7 54,6.9 53.7,6.6 X17.4
N$70
  Top 0.152: U16.2 66.2,18.4 65.5,18.4 63.9,16.8 63.9,16.5 C7.1
N$71
  Top 0.152: U16.1 66.2,17.7 65.2,16.7 65.2,16.6 C7.2
N$72  (via drill 0.3)
  Top 0.152: U16.9 67.62,22.98 v67.7,23 | v67.6,27.7 66.7,28.6 66.7,29.3 67,29.6 67.25,29.6 67.55,29.9 67.95,29.9 68.15,30.1 68.15,30.4 66.95,31.6 66.7,31.6 66.6,31.6 63.6,31.6 63,31 63,29.15 R7.2
  Bottom 0.152: v67.7,23 67.7,23.2 67.9,23.4 67.9,24.05 67.5,24.45 67.5,27.6 v67.6,27.7
N$73  (via drill 0.3)
  Top 0.152: U16.6 65.28,21.02 v65.2,21.1 | v63.3,27.9 63.6,27.9 63.7,27.9 63.9,28.1 64.35,28.1 R8.2
  Bottom 0.152: v65.2,21.1 65,21.3 65,23.6 64.4,24.2 64.4,24.8 63.1,26.1 63.1,27.5 63.1,27.7 v63.3,27.9
N$74
  Top 0.152: 62.8,16.4 C8.2 62.9,16.55 63.5,17.1 65.5,19.1 66.2,19.1 U16.3
N$76  (via drill 0.3)
  Top 0.152: v30.8,48.6 29.1,48.6 U11.3 | v31,51.4 31,52.1 30.9,52.2 31,52.3 R25.1
  Bottom 0.152: v30.8,48.6 30.6,48.8 30.6,51 v31,51.4
N$78  (via drill 0.3)
  Top 0.152: v78.45,30.9 76.6,30.9 76.5,31 75.6,31 74.5,32.1 71.3,32.1 71,31.8 71,31.4 69.4,29.8 69.4,25 70.9,23.5 71.3,23.5 U17.19
  Bottom 0.152: v78.45,30.9 78.45,30.55 78.3,30.4 77.3,30.4 U5.15
N$79  (via drill 0.3)
  Top 0.152: U17.24 71.3,20.3 70.7,20.3 v70.3,20.7
  Bottom 0.152: U5.1 71.3,29.7 70.9,29.7 70.9,25.3 70.6,25 70.6,24.6 71.2,24 71.2,21.6 v70.3,20.7
N$80  (via drill 0.3)
  Top 0.152: v72.3,23.7 72.3,24.2 73.2,25.1 73.2,25.9 72.2,26.9 70.4,26.9 v70.3,27 | U17.25 70.58,19.62 v70.4,19.6
  Bottom 0.152: U5.2 71.3,30.4 70.45,30.4 70.2,30.15 70.2,27 v70.3,27 | v72.3,23.7 72.3,20.7 71.2,19.6 v70.4,19.6
N$81  (via drill 0.3)
  Top 0.152: v69.45,18.85 69.6,19 71.29,19 U17.26 | v68.8,23.6 69.95,23.6 v70.1,23.45
  Bottom 0.152: v69.45,18.85 69.3,19.05 69.3,20.8 69,21.05 69,21.7 69.4,22.05 69.4,22.5 68.8,23.1 v68.8,23.6 | v70.1,23.45 69.8,23.65 69.8,26.7 69.75,26.75 69.75,30.25 70.5,31 71.34,31 U5.3
N$82  (via drill 0.3)
  Top 0.152: v72.3,25.9 72,25.5 71.4,25.5 U17.16
  Bottom 0.152: v72.3,25.9 72.7,26.4 72.7,31.5 72.5,31.7 71.41,31.7 U5.4
N$83  (via drill 0.3)
  Top 0.152: v72.3,25 72.09,24.8 U17.17
  Bottom 0.152: U5.5 71.4,32.3 72.6,32.3 73.6,31.3 73.6,25.9 73.4,25.7 72.6,25 v72.3,25
N$84  (via drill 0.3)
  Top 0.406: v78.9,20.2 77.6,20.2 U17.5
  Bottom 0.406: v78.9,20.2 78.6,19.9 78.1,19.9 77.4,19.2 77.4,15.8 74.7,13.1 74.7,8.4 72.7,6.4 X18.1
N$85  (via drill 0.3)
  Top 0.406: v79.2,13.6 72.6,13.6 v72.2,13.2 | U17.7 77.5,21.6 79.3,21.6 v79.6,21.3
  Bottom 0.406: v79.6,21.3 79.6,15 79.4,14.7 79.4,13.8 v79.2,13.6 | v72.2,13.2 72,12.9 72,11.8 72.5,11.3 72.5,10.5 72,10 72,8.2 70.6,6.9 70.5,6.9 70.2,6.6 70.2,5.6 X18.2
N$86  (via drill 0.3)
  Top 0.4: 79.8,14.3 v80.2,14.7
  Top 0.406: v79.9,23.3 78.4,23.3 78.1,23.5 77.5,23.5 U17.10 | 79.8,14.3 77.9,14.3 77.8,14.2 70.7,14.2 v69.7,13.2
  Bottom 0.406: v79.9,23.3 80.3,22.9 80.3,21 80.2,20.9 v80.2,14.7 | v69.7,13.2 69.5,12.9 69.5,11.7 69,11.2 69,10.6 69.4,10.1 69.4,8.3 67.6,6.5 67.6,5.6 X18.3
N$87  (via drill 0.3)
  Top 0.406: v85,9 84.1,8.1 80.5,8.1 80.4,8.15 67.3,8.15 65.6,6.5 65.6,5.7 65.5,5.6 X18.4 | v81.2,22 81,22.2 77.5,22.2 U17.8
  Bottom 0.406: v85,9 85,18.2 v81.2,22
N$88
  Top 0.152: U17.2 77.4,18.4 75.9,18.4 75,17.5 75,16.2 C9.1
N$89
  Top 0.152: U17.1 77.4,17.8 76.5,17.8 76.3,17.6 76.3,16.2 C9.2
N$90  (via drill 0.3)
  Top 0.152: U17.9 77.5,22.9 78.1,22.9 78.45,22.65 80.7,22.65 v81.05,23 | v76.6,26.7 74.4,26.7 73.3,27.8 72.9,27.8 R9.2
  Bottom 0.152: v81.05,23 80.9,27.2 79.6,28.5 78.6,28.5 76.8,26.7 v76.6,26.7
N$91  (via drill 0.3)
  Top 0.152: v78.5,20.9 77.5,20.9 U17.6 | v78.5,27.6 78.3,27.8 75.6,27.8 R10.2
  Bottom 0.152: v78.5,20.9 v78.5,27.6
N$92  (via drill 0.3)
  Top 0.152: v78.5,18.9 77.5,18.9 U17.3 | v78.5,16.1 77.4,16.1 76.8,15.5 74.3,15.5 74.1,15.7 74.1,16.15 C10.2
  Bottom 0.152: v78.5,16.1 v78.5,18.9
N$93  (via drill 0.3)
  Top 0.152: v70.2,22.3 70.35,22.2 71.3,22.2 U17.21
  Bottom 0.152: 70.1,22.5 v70.2,22.3 69.4,23.1 69.4,30.9 70.1,31.7 70.1,32.5 70.6,33 71.34,33 U5.6 71.3,33
N$94  (via drill 0.3)
  Top 0.152: v30.3,48 29.1,48 U11.4 | v30.2,51.4 29.7,51.9 29.7,52.2 R28.1
  Bottom 0.152: v30.3,48 30.2,48.1 v30.2,51.4
N$95  (via drill 0.3)
  Top 0.152: v27.8,47.3 29,47.3 U11.5 | v27.9,51.4 28.1,51.6 28.1,52.2 28.3,52.2 R29.1
  Bottom 0.152: v27.8,47.3 27.9,47.4 v27.9,51.4
N$96
  Top 0.3: R11.1 96,43.05 LED4.A
N$97
  Bottom 0.152: R12.1 30,34.9 30,34 30.8,33.2 32.2,33.2 U1.10
N$98
  Bottom 0.152: U4.10 66,33.6 65,33.6 64.9,33.7 64.6,33.7 63.7,34.6 63.7,35.4 R33.1
N$99
  Bottom 0.152: U5.10 75.97,33.63 75.35,34.25 75.35,35.9 R34.1
N$100  (via drill 0.3)
  Top 0.152: v45.95,40.3 44.1,40.3 43.15,39.35 v42.2,39.35
  Bottom 0.152: U2.10 44.7,33.4 46,33.4 46.35,33 46.35,32.7 46.2,32.5 46.2,32.15 46.55,31.7 46.95,31.7 47.6,32.4 47.6,32.95 46.15,34.4 46.15,36 45.7,36.5 45.7,38.4 45.95,38.75 v45.95,40.3 | v42.2,39.35 42.2,36.15 R35.1
N$101
  Bottom 0.152: U3.10 55.3,33.6 54.2,33.6 53.9,33.9 53.9,35.1 R36.1
N$112  (via drill 0.3)
  Top 0.152: v36.2,47.4 36.1,47.3 35,47.3 U11.24 | v36.2,51.4 36,51.6 36,52.3 35.9,52.3 R30.1
  Bottom 0.152: v36.2,47.4 v36.2,51.4
N$114  (via drill 0.3)
  Top 0.3: v44.7,35.4 v46.7,35.4 | v38.6,25.8 40.6,25.8 v40.8,26 | v37.9,3.3 74,3.3 74.5,3.8 v75.5,3.8 | v77.5,10.5 77.9,10.9 v82.1,10.9 | v44.5,41 Q5.4 | v49.2,35.1 50,35.1 Q5.2
  Top 0.406: v84.5,4 85.1,4.6 85.1,4.8 85.6,5.3 X6.2 | v84.4,1.3 84.3,1.2 83.5,1.2 LED7.C
  Bottom 0.3: v40.8,26 41.55,26.85 41.55,28.95 41.7,29.1 41.7,33.45 42.55,33.45 43.1,34 43.1,35 43.6,35.4 v44.7,35.4 44.7,35.65 44.5,35.85 44.1,36.3 44.1,40.6 v44.5,41 | v38.6,25.8 38,25.2 38,14.4 36.65,13.1 36.65,9.2 36.7,9.1 36.7,8.7 37.7,7.7 37.7,7 37.4,6.7 37.4,3.8 v37.9,3.3 | v75.5,3.8 76.5,4.8 76.5,8.3 77.2,9 77.2,10.2 v77.5,10.5 | v82.1,10.9 82.1,10.4 82.3,10.2 82.3,8.6 84.8,6.1 85.6,6.1 85.6,5.5 X6.2 | v46.7,35.4 48.9,35.4 v49.2,35.1
  Bottom 0.406: v84.5,4 84.4,3.9 v84.4,1.3
N$115  (via drill 0.3)
  Top 0.3: v66.4,39.3 66.4,39 65.95,38.5 63.3,38.5 63.2,38.6 v60.7,38.6 | v67.9,36.8 75.8,36.8 v75.9,36.7 | v75.9,34.8 77.2,33.5 v80.4,33.5 | v82.1,22.4 83.1,22.4 v91.4,14.1
  Top 0.4: v60.9,42.7 Q4.4 | v59.8,35.2 60.6,35.2 Q4.2
  Top 0.406: v91.4,3.7 92.1,4.4 92.1,5.1 92.4,5.4 X5.2 | v91.2,1.3 91.1,1.2 90.3,1.2 LED6.C
  Bottom 0.3: v66.4,39.3 66.4,38.3 v67.9,36.8 | v75.9,34.8 v75.9,36.7 | v80.4,33.5 81.8,32.1 81.8,30.5 82.1,30.2 v82.1,22.4 | v91.4,14.1 91.4,7.3 92.4,6.3 92.4,5.6 X5.2
  Bottom 0.4: 61,42.8 v60.9,42.7 60.7,42.5 v60.7,38.6 60.7,36 v59.8,35.2
  Bottom 0.406: v91.4,3.7 91.4,1.5 v91.2,1.3
N$116  (via drill 0.3)
  Top 0.4: v41,32.1 40.9,32.2 34.4,32.2 34,31.8 30.65,31.8 28.55,33.9 25.7,33.9 25.45,34.1 22.1,34.1 19.75,31.75 v19.7,31.4 | v42.3,34.1 42.3,34 41.3,34 Q6.2 41.3,35.7 41.4,35.8 41.5,35.8 42.3,36.6 43.2,36.6 v43.3,36.5 | v20.9,7 20.4,7.5 19.8,7.5 v19.5,7.8 | v19.5,21.3 19.5,22.6 20.6,23.7 20.6,25 v19.7,25.9 | v68.3,1.2 68.4,1.1 69.7,1.1 70.3,1.7 70.3,2.2 70.8,2.7 74,2.7 v74.1,2.6 | v68.3,2.6 68.2,2.7 43.8,2.7 v43.7,2.6 | v34.7,2.6 34.4,2.9 31.8,2.9 v31.7,2.8 | v30.9,2 30.8,1.9 28.8,1.9 28.5,2.2 v28.5,2.3 | v21.3,1.4 v27.6,1.4 | v77.15,7.45 77.1,7.4 v75.8,7.4 | v43.6,41.1 Q6.4
  Top 0.406: v77.5,1.3 77.4,1.2 76.6,1.2 LED5.C | X4.2 v77.6,5.6
  Bottom 0.4: v41,32.1 41,34.1 v42.3,34.1 | v21.3,1.4 20.9,1.8 v20.9,7 | v19.5,7.8 v19.5,21.3 | v19.7,25.9 v19.7,31.4 | v68.3,2.6 v68.3,1.2 | v43.7,2.6 43.7,3.1 43.3,3.5 43.1,3.5 43,3.4 42.4,3.4 42.3,3.3 40.2,3.3 38.2,1.3 35.3,1.3 34.7,1.9 v34.7,2.6 | v30.9,2 v31.7,2.8 | v27.6,1.4 v28.5,2.3 | v75.8,7.4 75.9,7.3 75.9,5 75.4,4.5 75.2,4.5 74.8,4.1 74.8,3.7 74.3,3.2 74.3,2.8 v74.1,2.6 | v77.15,7.45 77.2,7.23 X4.2 | v43.6,41.1 43.4,40.9 43.4,36.6 v43.3,36.5
  Bottom 0.406: v77.6,5.6 77.4,5.4 77.4,1.4 v77.5,1.3
N$117
  Top 0.406: LED6.A 90.3,4.5 90.4,4.5 R20.1
N$118
  Top 0.406: R21.1 83.5,2.8 83.4,2.7 83.5,2.6 LED7.A
N$127
  Top 0.152: R15.1 13.9,35.5 12.5,35.5 LED3.A
N$128
  Top 0.3: U6.10 77.45,45.05 77.7,44.8 78.55,44.8 C51.1
N$129
  Top 0.3: LED1.A R14.1
N$130
  Top 0.152: LED2.A R16.1
N$133
  Top 0.3: Q3.4 17.65,31.6 R32.1
N$147  (via drill 0.3)
  Top 0.152: v86.5,49.5 85.9,50.1 83.9,50.1 S2.3
  Bottom 0.152: 86.5,50.4 88.4,50.4 88.41,50.4 U18.1 | v86.5,49.5 86.5,50.4 | 86.5,50.4 R24.1
N$148  (via drill 0.3)
  Top 0.152: v85.8,48.3 83.9,48.3 S2.4
  Bottom 0.152: v85.8,48.3 85.8,51 86.4,51.6 R23.1 86.5,51.6 86.5,51.7 88.5,51.7 U18.2
N$149
  Bottom 0.152: R22.1 86.4,52.9 86.5,53 86.6,52.9 88.4,52.9 88.44,52.94 U18.3
N$233
  Top 0.406: U10.7 R43.1 59.5,51.95 R42.2
N$234  (via drill 0.3)
  Top 0.152: v11.6,33.6 12.5,33.6 LED3.C | C59.1 17.6,25.7 16.7,25.7 Q3.5
  Top 0.3: Q3.6 Q3.5
  Top 3: X3.2 9.74,25.8 Q3.8 Q3.7 Q3.6
  Bottom 0.152: v11.6,33.6 11.6,33.5 11.9,33.2 11.9,30.4 9.2,27.7 9.2,26.6 X3.2
  Bottom 0.5: X3.2 5.1,26.36 D1.A
N$237
  Bottom 0.3: R38.1 21.5,68.7 21.4,68.6 21.3,68.7 21,68.7 C14.1 20.9,68.7 19.2,68.7 R13.1 19.1,68.7 18.5,68.7 18.1,68.3 18.1,66.7 18.5,66.3 18.6,66.3 19.7,65.2 19.7,64.2 X9.1
N$238  (via drill 0.3)
  Top 0.152: v53.4,54 53.4,54.3 52.8,54.9 52.6,54.9 52.6,55.2 C55.2 | v53.3,51.4 53.2,51.3 52.4,51.3 U10.5 | D4.C 42.3,49.9 42.35,49.95 45.85,49.95 L2.P$2
  Top 0.406: U10.5 46.8,51.3 47.14,51 | L2.P$2 47.14,51 | 47.14,51 46.05,49.9
  Bottom 0.152: v53.4,54 53.3,53.9 v53.3,51.4
N$239
  Top 0.3: U6.8 76.35,42.95 76.1,42.7 76.1,41.85 R41.1
N$240